# Altium schematic sheet 4_DDS.SCHDOC
size 297 x 209 mm; SheetNumber: 12; SheetTotal: 18; DocumentName: 4_DDS.SCHDOC
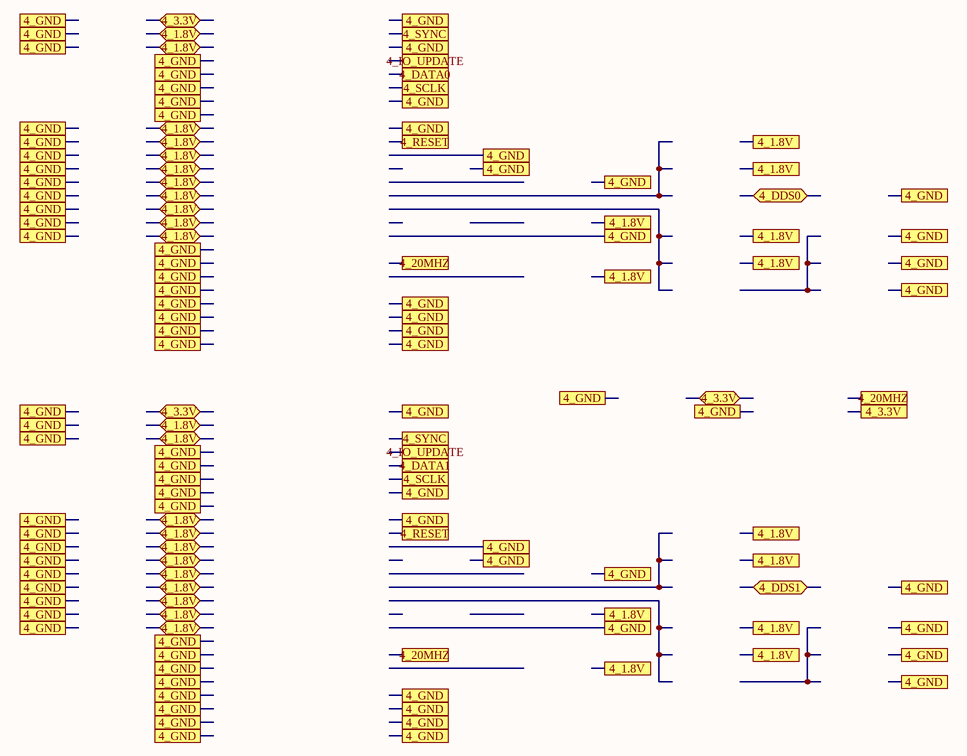
[diagram p0: 4_DDS.SCHDOC]

## Ports
4_1.8V, 4_1.8V (bidir), 4_3.3V, 4_3.3V (bidir), 4_20MHZ, 4_DATA0, 4_DATA1, 4_DDS0 (bidir), 4_DDS1 (bidir), 4_GND, 4_IO_UPDATE, 4_RESET, 4_SCLK, 4_SYNC

## Notes on the sheet
- A
- B
- C
- D
- 1
- 2
- 3
- Title
- 4
- Size
- A4
- Number
- Rev
- Date
- Filename
- Drawn by
- Sheet
- of